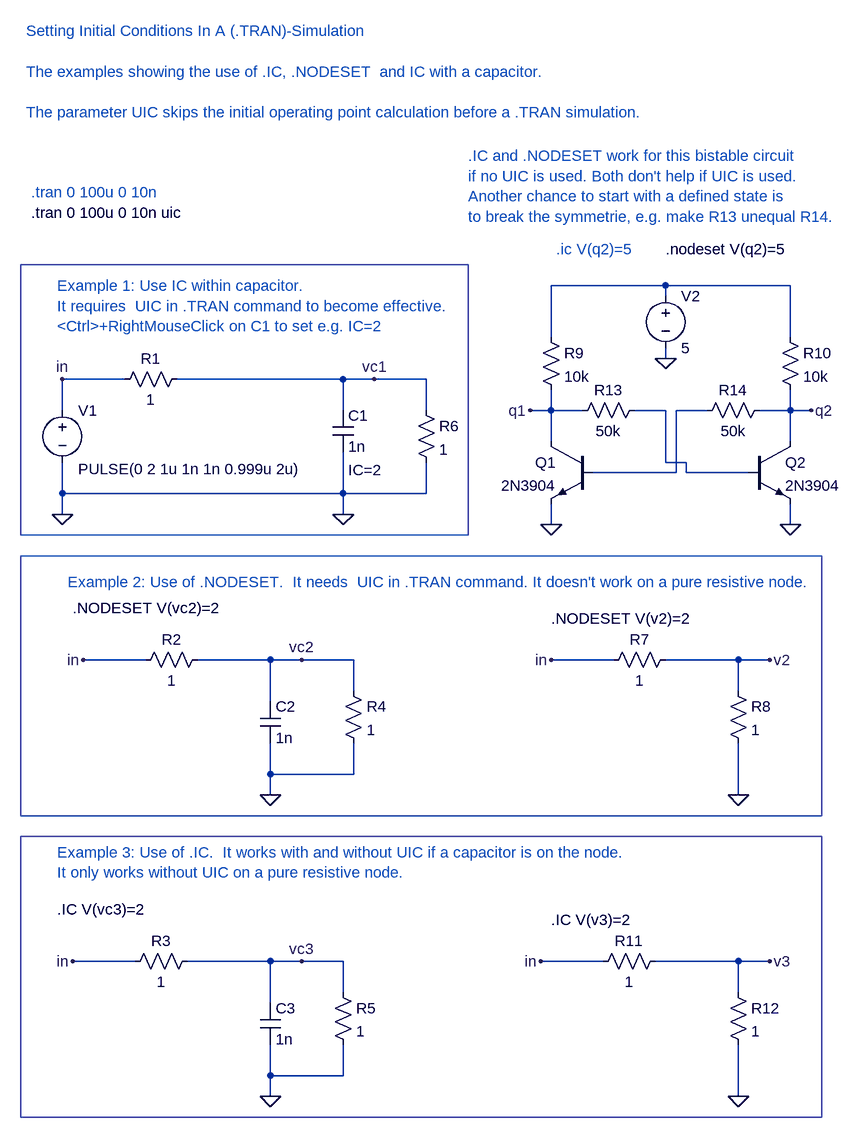
[diagram p0: schematic IC_Nodeset_test1.asc]
IC_Nodeset_test1.asc, the LTspice schematic file:
Version 4
SHEET 1 1848 1300
WIRE -96 208 -96 160
WIRE -96 336 -96 288
WIRE -96 368 -96 336
WIRE 0 160 -96 160
WIRE 16 1056 -80 1056
WIRE 32 592 -64 592
WIRE 224 592 112 592
WIRE 224 656 224 592
WIRE 224 768 224 720
WIRE 224 800 224 768
WIRE 224 1056 96 1056
WIRE 224 1120 224 1056
WIRE 224 1232 224 1184
WIRE 224 1264 224 1232
WIRE 272 592 224 592
WIRE 272 1056 224 1056
WIRE 336 160 80 160
WIRE 336 208 336 160
WIRE 336 336 -96 336
WIRE 336 336 336 272
WIRE 336 368 336 336
WIRE 336 1056 272 1056
WIRE 336 1104 336 1056
WIRE 336 1232 224 1232
WIRE 336 1232 336 1184
WIRE 352 592 272 592
WIRE 352 640 352 592
WIRE 352 768 224 768
WIRE 352 768 352 720
WIRE 384 160 336 160
WIRE 464 160 384 160
WIRE 464 208 464 160
WIRE 464 336 336 336
WIRE 464 336 464 288
WIRE 656 96 656 16
WIRE 656 208 624 208
WIRE 656 208 656 176
WIRE 656 256 656 208
WIRE 656 384 656 352
WIRE 704 208 656 208
WIRE 736 1056 640 1056
WIRE 752 592 656 592
WIRE 832 16 656 16
WIRE 832 32 832 16
WIRE 832 128 832 112
WIRE 832 208 784 208
WIRE 832 288 832 208
WIRE 848 304 720 304
WIRE 848 304 848 208
WIRE 864 288 832 288
WIRE 864 304 864 288
WIRE 896 208 848 208
WIRE 944 592 832 592
WIRE 944 640 944 592
WIRE 944 800 944 720
WIRE 944 1056 816 1056
WIRE 944 1104 944 1056
WIRE 944 1264 944 1184
WIRE 960 304 864 304
WIRE 992 592 944 592
WIRE 992 1056 944 1056
WIRE 1024 16 832 16
WIRE 1024 96 1024 16
WIRE 1024 208 976 208
WIRE 1024 208 1024 176
WIRE 1024 256 1024 208
WIRE 1024 384 1024 352
WIRE 1056 208 1024 208
FLAG -96 368 0
FLAG 384 160 vc1
FLAG 272 592 vc2
FLAG 272 1056 vc3
FLAG -96 160 in
FLAG 336 368 0
FLAG 224 800 0
FLAG 224 1264 0
FLAG -64 592 in
FLAG -80 1056 in
FLAG 992 592 v2
FLAG 944 800 0
FLAG 656 592 in
FLAG 992 1056 v3
FLAG 944 1264 0
FLAG 640 1056 in
FLAG 656 384 0
FLAG 1024 384 0
FLAG 832 128 0
FLAG 624 208 q1
FLAG 1056 208 q2
SYMBOL res -16 176 R270
WINDOW 0 32 56 VTop 0
WINDOW 3 0 56 VBottom 0
SYMATTR InstName R1
SYMATTR Value 1
SYMBOL voltage -96 192 R0
WINDOW 3 24 106 Left 0
WINDOW 123 0 0 Left 0
WINDOW 39 0 0 Left 0
SYMATTR Value PULSE(0 2 1u 1n 1n 0.999u 2u)
SYMATTR InstName V1
SYMBOL res 16 608 R270
WINDOW 0 32 56 VTop 0
WINDOW 3 0 56 VBottom 0
SYMATTR InstName R2
SYMATTR Value 1
SYMBOL res 0 1072 R270
WINDOW 0 32 56 VTop 0
WINDOW 3 0 56 VBottom 0
SYMATTR InstName R3
SYMATTR Value 1
SYMBOL res 336 624 R0
SYMATTR InstName R4
SYMATTR Value 1
SYMBOL res 320 1088 R0
SYMATTR InstName R5
SYMATTR Value 1
SYMBOL res 448 192 R0
SYMATTR InstName R6
SYMATTR Value 1
SYMBOL cap 320 208 R0
WINDOW 123 24 92 Left 0
SYMATTR Value2 IC=2
SYMATTR InstName C1
SYMATTR Value 1n
SYMBOL cap 208 656 R0
SYMATTR InstName C2
SYMATTR Value 1n
SYMBOL cap 208 1120 R0
SYMATTR InstName C3
SYMATTR Value 1n
SYMBOL res 736 608 R270
WINDOW 0 32 56 VTop 0
WINDOW 3 0 56 VBottom 0
SYMATTR InstName R7
SYMATTR Value 1
SYMBOL res 928 624 R0
SYMATTR InstName R8
SYMATTR Value 1
SYMBOL res 720 1072 R270
WINDOW 0 32 56 VTop 0
WINDOW 3 0 56 VBottom 0
SYMATTR InstName R11
SYMATTR Value 1
SYMBOL res 928 1088 R0
SYMATTR InstName R12
SYMATTR Value 1
SYMBOL npn 720 256 M0
SYMATTR InstName Q1
SYMATTR Value 2N3904
SYMBOL npn 960 256 R0
SYMATTR InstName Q2
SYMATTR Value 2N3904
SYMBOL res 640 80 R0
SYMATTR InstName R9
SYMATTR Value 10k
SYMBOL res 1008 80 R0
SYMATTR InstName R10
SYMATTR Value 10k
SYMBOL res 688 224 R270
WINDOW 0 32 56 VTop 0
WINDOW 3 0 56 VBottom 0
SYMATTR InstName R13
SYMATTR Value 50k
SYMBOL res 880 224 R270
WINDOW 0 32 56 VTop 0
WINDOW 3 0 56 VBottom 0
SYMATTR InstName R14
SYMATTR Value 50k
SYMBOL voltage 832 16 R0
SYMATTR InstName V2
SYMATTR Value 5
TEXT -144 -128 Left 0 ;.tran 0 100u 0 10n
TEXT -104 976 Left 0 !.IC V(vc3)=2
TEXT -80 512 Left 0 !.NODESET V(vc2)=2
TEXT -104 16 Left 0 ;Example 1: Use IC within capacitor.  \nIt requires  UIC in .TRAN command to become effective.\n<Ctrl>+RightMouseClick on C1 to set e.g. IC=2
TEXT -88 472 Left 0 ;Example 2: Use of .NODESET.  It needs  UIC in .TRAN command. It doesn't work on a pure resistive node.
TEXT -104 888 Left 0 ;Example 3: Use of .IC.  It works with and without UIC if a capacitor is on the node. \nIt only works without UIC on a pure resistive node.
TEXT -144 -96 Left 0 !.tran 0 100u 0 10n uic
TEXT -152 -376 Left 0 ;Setting Initial Conditions In A (.TRAN)-Simulation\n \nThe examples showing the use of .IC, .NODESET  and IC with a capacitor.\n \nThe parameter UIC skips the initial operating point calculation before a .TRAN simulation.
TEXT 656 528 Left 0 !.NODESET V(v2)=2
TEXT 656 992 Left 0 !.IC V(v3)=2
TEXT 664 -40 Left 0 ;.ic V(q2)=5
TEXT 832 -40 Left 0 !.nodeset V(q2)=5
TEXT 528 -184 Left 0 ;.IC and .NODESET work for this bistable circuit \nif no UIC is used. Both don't help if UIC is used.\nAnother chance to start with a defined state is \nto break the symmetrie, e.g. make R13 unequal R14.
RECTANGLE Normal 1072 832 -160 432
RECTANGLE Normal 1072 1296 -160 864
RECTANGLE Normal 528 400 -160 -16

The netlist it stands for:
* IC_Nodeset_test1.asc
R1 in vc1 1
V1 in 0 PULSE(0 2 1u 1n 1n 0.999u 2u)
R2 in vc2 1
R3 in vc3 1
R4 vc2 0 1
R5 vc3 0 1
R6 vc1 0 1
C1 vc1 0 1n IC=2
C2 vc2 0 1n
C3 vc3 0 1n
R7 in v2 1
R8 v2 0 1
R11 in v3 1
R12 v3 0 1
Q1 q1 N003 0 0 2N3904
Q2 q2 N002 0 0 2N3904
R9 N001 q1 10k
R10 N001 q2 10k
R13 q1 N002 50k
R14 N003 q2 50k
V2 N001 0 5
.model NPN NPN
.model PNP PNP
.lib standard.bjt
* .tran 0 100u 0 10n
.IC V(vc3)=2
.NODESET V(vc2)=2
* Example 1: Use IC within capacitor.
* It requires  UIC in .TRAN command to become effective.
* <Ctrl>+RightMouseClick on C1 to set e.g. IC=2
* Example 2: Use of .NODESET.  It needs  UIC in .TRAN command. It doesn't work on a pure resistive node.
* Example 3: Use of .IC.  It works with and without UIC if a capacitor is on the node.
* It only works without UIC on a pure resistive node.
.tran 0 100u 0 10n uic
* Setting Initial Conditions In A (.TRAN)-Simulation
* The examples showing the use of .IC, .NODESET  and IC with a capacitor.
* The parameter UIC skips the initial operating point calculation before a .TRAN simulation.
.NODESET V(v2)=2
.IC V(v3)=2
* .ic V(q2)=5
.nodeset V(q2)=5
* .IC and .NODESET work for this bistable circuit
* if no UIC is used. Both don't help if UIC is used.
* Another chance to start with a defined state is
* to break the symmetrie, e.g. make R13 unequal R14.
.backanno
.end